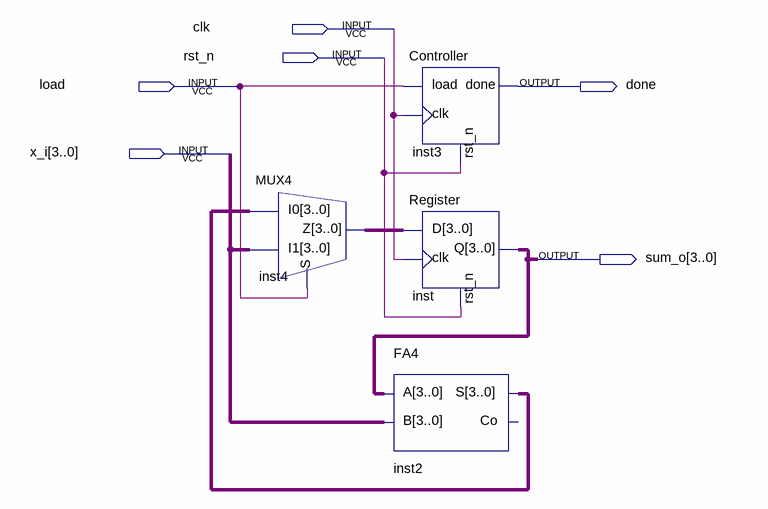
[diagram p0: schematic sheet]
// Quartus schematic AC4.bdf as structural Verilog: 4 symbols, 6 pins
module AC4 (
  input  clk,
  input  rst_n,
  input  load,
  input  [3:0] x_i,
  output done,
  output [3:0] sum_o
);

  wire [3:0] inst2_s, inst4_z;

  MUX4 inst4 (.I0(inst2_s), .I1(x_i), .S(load), .Z(inst4_z));
  Controller inst3 (.rst_n(rst_n), .clk(clk), .load(load), .done(done));
  Register inst (.D(inst4_z), .clk(clk), .rst_n(rst_n), .Q(sum_o));
  FA4 inst2 (.A(sum_o), .B(x_i), .S(inst2_s));  // open: Co
endmodule
